# EAGLE design BOARD4 (EAGLE 9.6.2)
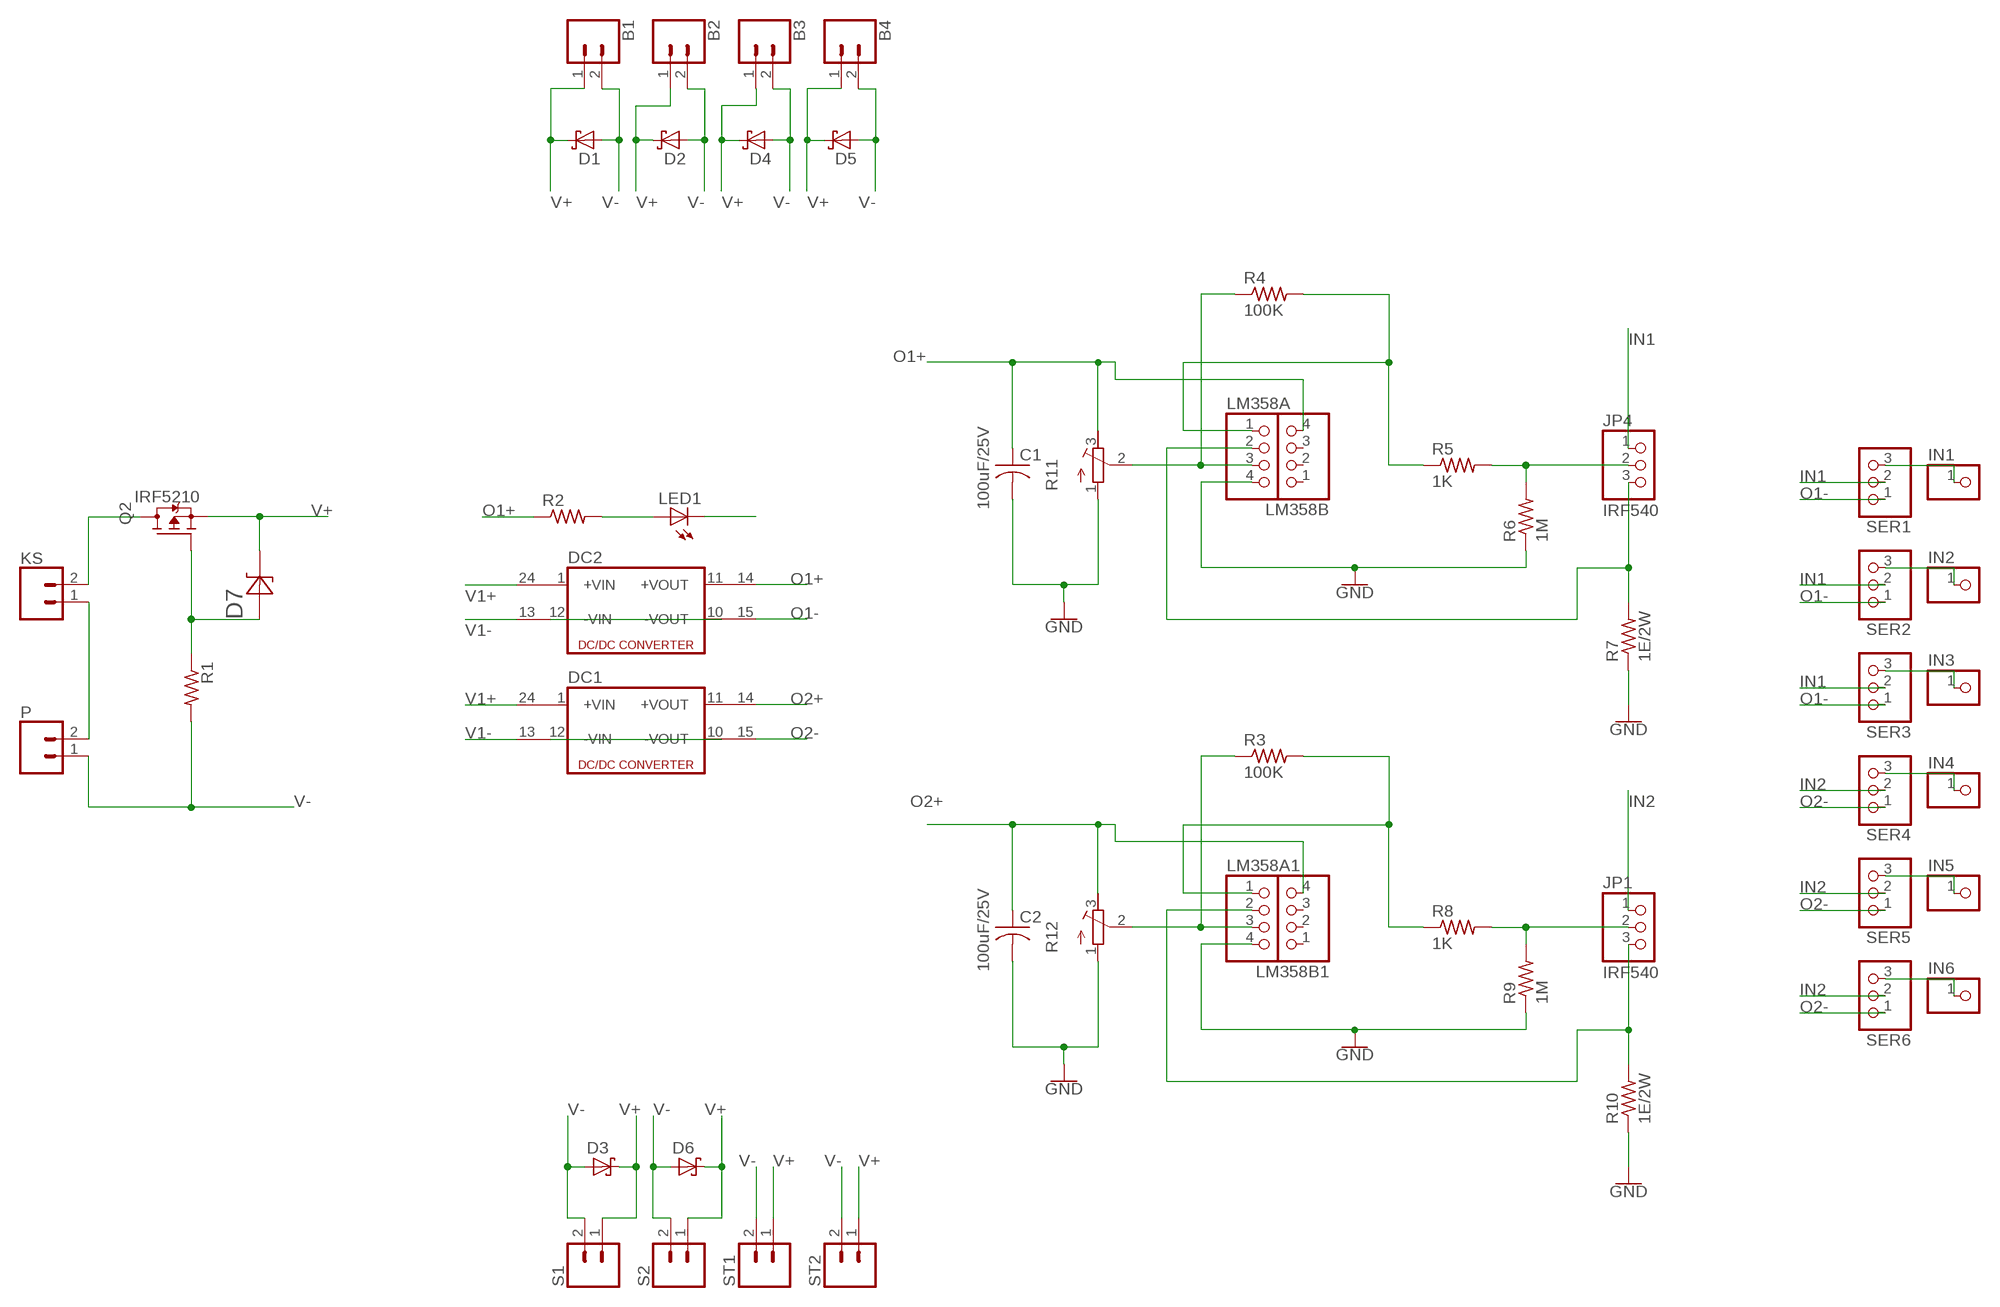
[diagram p0: schematic, sheet 1]

## Parts
B1  CONN_02  [1X02]
B2  CONN_02  [1X02]
B3  CONN_02  [1X02]
B4  CONN_02  [1X02]
C1  100uF/25V  C-US025-024X044  [C025-024X044]
C2  100uF/25V  C-US025-024X044  [C025-024X044]
D1  SCHOTTKY-DIODEF126Z12  [F126Z12]
D2  SCHOTTKY-DIODEF126Z12  [F126Z12]
D3  SCHOTTKY-DIODEF126Z12  [F126Z12]
D4  SCHOTTKY-DIODEF126Z12  [F126Z12]
D5  SCHOTTKY-DIODEF126Z12  [F126Z12]
D6  SCHOTTKY-DIODEF126Z12  [F126Z12]
D7  1N4752A-T  [DIOAD1060W80L410D260]
DC1  DC213R  [CMK]
DC2  DC213R  [CMK]
IN1  PINHD-1X1  [1X01]
IN2  PINHD-1X1  [1X01]
IN3  PINHD-1X1  [1X01]
IN4  PINHD-1X1  [1X01]
IN5  PINHD-1X1  [1X01]
IN6  PINHD-1X1  [1X01]
JP1  IRF540  PINHD-1X3  [1X03]
JP4  IRF540  PINHD-1X3  [1X03]
KS  CONN_02  [1X02]
LED1  LED5MM  [LED5MM]
LM358A  PINHD-1X4  [1X04]
LM358A1  PINHD-1X4  [1X04]
LM358B  PINHD-1X4  [1X04]
LM358B1  PINHD-1X4  [1X04]
P  CONN_02  [1X02]
Q2  IRF5210  [TO254P1054X469X2933-3]
R1  R-US_0204/7  [0204/7]
R2  R-US_0204/7  [0204/7]
R3  100K  R-US_0204/5  [0204/5]
R4  100K  R-US_0204/5  [0204/5]
R5  1K  R-US_0204/5  [0204/5]
R6  1M  R-US_0204/5  [0204/5]
R7  1E/2W  R-US_0204/5  [0204/5]
R8  1K  R-US_0204/5  [0204/5]
R9  1M  R-US_0204/5  [0204/5]
R10  1E/2W  R-US_0204/5  [0204/5]
R11  R-TRIMM3339P  [RTRIM3339P]
R12  R-TRIMM3339P  [RTRIM3339P]
S1  CONN_02  [1X02]
S2  CONN_02  [1X02]
SER1  PINHD-1X3  [1X03]
SER2  PINHD-1X3  [1X03]
SER3  PINHD-1X3  [1X03]
SER4  PINHD-1X3  [1X03]
SER5  PINHD-1X3  [1X03]
SER6  PINHD-1X3  [1X03]
ST1  CONN_02  [1X02]
ST2  CONN_02  [1X02]

## Nets
GND: C1.2 C2.2 LM358A1.4 LM358A.4 R6.1 R7.1 R9.1 R10.1 R11.1(A) R12.1(A)
IN1: JP4.1 SER1.2 SER2.2 SER3.2
IN2: JP1.1 SER4.2 SER5.2 SER6.2
N$1: KS.1 P.2
N$2: KS.2 Q2.2(D)
N$3: D7.A Q2.1(G) R1.1
N$6: JP4.3 LM358A.2 R7.2
N$9: LM358A.3 R4.1 R11.2(S)
N$10: LM358A.1 R4.2 R5.1
N$11: JP4.2 R5.2 R6.2
N$15: LM358A1.3 R3.1 R12.2(S)
N$16: LM358A1.1 R3.2 R8.1
N$17: JP1.2 R8.2 R9.2
N$18: JP1.3 LM358A1.2 R10.2
N$28: DC2.10(-VOUT) DC2.12(-VIN)
N$29: DC1.10(-VOUT) DC1.12(-VIN)
N$38: LED1.A R2.2
N$39: LED1.K(C)
N$53: IN1.1 SER1.3
N$54: IN2.1 SER2.3
N$55: IN3.1 SER3.3
N$56: IN4.1 SER4.3
N$57: IN5.1 SER5.3
N$58: IN6.1 SER6.3
O1+: C1.1 DC2.14(+VOUT1) LM358B.4 R2.1 R11.3(E)
O1-: DC2.15(-VOUT1) SER1.1 SER2.1 SER3.1
O2+: C2.1 DC1.14(+VOUT1) LM358B1.4 R12.3(E)
O2-: DC1.15(-VOUT1) SER4.1 SER5.1 SER6.1
V1+: DC1.24(+VIN1) DC2.24(+VIN1)
V1-: DC1.13(-VIN1) DC2.13(-VIN1)
V+: B1.1 B2.1 B3.1 B4.1 D1.C D2.C D3.C D4.C D5.C D6.C D7.C Q2.3(S) S1.1 S2.1 ST1.1 ST2.1
V-: B1.2 B2.2 B3.2 B4.2 D1.A D2.A D3.A D4.A D5.A D6.A P.1 R1.2 S1.2 S2.2 ST1.2 ST2.2
Unconnected: DC1.1(+VIN) DC1.11(+VOUT) DC2.1(+VIN) DC2.11(+VOUT) LM358B1.1 LM358B1.2 LM358B1.3 LM358B.1 LM358B.2 LM358B.3

## Library data of the parts
B1-B4 KS P S1 S2 ST1 ST2 = SparkFun-Connectors:CONN_02: Multi connection point. Often used as Generic Header-pin footprint for 0.1 inch spaced/style header connections On any of the 0.1 inch spaced packages, you can populate with these: Break Away Headers - Straight <https://www.sparkfun.com/products/116> (PRT-00116) Break Away Male Headers - Right Angle <https://www.sparkfun.com/products/553> (PRT-00553) Female Headers <https://www.sparkfun.com/products/115> (PRT-00115) Break Away Headers - Machine Pin <https://www.sparkfun.com/products/117> (PRT-00117) Break Away Female Headers - Swiss Machine Pin <https://www.sparkfun.com/products/743> (PRT-00743) For SCREWTERMINALS and SPRING TERMINALS visit here: Screw Terimnals on SparkFun.com <https://www.sparkfun.com/search/results?term=Screw+Terminals> (5mm/3.5mm/2.54mm spacing) This device is also useful as a general connection point to wire up your design to another part of your project. Our various solder wires solder well into these plated through hole pads. Hook-Up Wire - Assortment (Stranded, 22 AWG) <https://www.sparkfun.com/products/11375> (PRT-11375) Hook-Up Wire - Assortment (Solid Core, 22 AWG) <https://www.sparkfun.com/products/11367> (PRT-11367) View the entire wire category on our website here <https://www.sparkfun.com/categories/141> Special notes: Molex polarized connector foot print use with: PRT-08233 with associated crimp pins and housings. 2.54_SCREWTERM for use with PRT-10571. 3.5mm Screw Terminal footprints for PRT-08084 5mm Screw Terminal footprints for use with PRT-08432
C1 C2 = rcl:C-US: CAPACITOR, American symbol; SPICEPREFIX: C
D1-D6 = adafruit:SCHOTTKY-DIODE: Schottky Diode
D7 = 1N4752A-T:1N4752A-T: DIODE ZENER 33V 1W DO41 Check prices <https://pricing.snapeda.com/parts/1N4752A/ON%20Semiconductor/view-part?ref=eda>; AVAILABILITY: In Stock; DESCRIPTION: Zener Diode 33 V 1 W ±5% Through Hole DO-41; MF: ON Semiconductor; MP: 1N4752A; PACKAGE: DO-41-2 ON Semiconductor; PRICE: None; PURCHASE-URL: https://pricing.snapeda.com/search/part/1N4752A/?ref=eda
DC1 DC2 = dc-dc-converter:DC213R: DC-DC CONVERTER; OC_FARNELL: unknown; OC_NEWARK: unknown
IN1-IN6 = pinhead:PINHD-1X1: PIN HEADER
JP1 JP4 SER1-SER6 = pinhead:PINHD-1X3: PIN HEADER
LED1 = adafruit:LED: LED OSRAM: - CHIPLED LG R971, LG N971, LY N971, LG Q971, LY Q971, LO R971, LY R971 LH N974, LH R974 LS Q976, LO Q976, LY Q976 LO Q996 - Hyper CHIPLED LW Q18S LB Q993, LB Q99A, LB R99A - SideLED LS A670, LO A670, LY A670, LG A670, LP A670 LB A673, LV A673, LT A673, LW A673 LH A674 LY A675 LS A676, LA A676, LO A676, LY A676, LW A676 LS A679, LY A679, LG A679 - Hyper Micro SIDELED® LS Y876, LA Y876, LO Y876, LY Y876 LT Y87S - SmartLED LW L88C, LW L88S LB L89C, LB L89S, LG L890 LS L89K, LO L89K, LY L89K LS L896, LA L896, LO L896, LY L896 - TOPLED LS T670, LO T670, LY T670, LG T670, LP T670 LSG T670, LSP T670, LSY T670, LOP T670, LYG T670 LG T671, LOG T671, LSG T671 LB T673, LV T673, LT T673, LW T673 LH T674 LS T676, LA T676, LO T676, LY T676, LB T676, LH T676, LSB T676, LW T676 LB T67C, LV T67C, LT T67C, LS T67K, LO T67K, LY T67K, LW E67C LS E67B, LA E67B, LO E67B, LY E67B, LB E67C, LV E67C, LT E67C LW T67C LS T679, LY T679, LG T679 LS T770, LO T770, LY T770, LG T770, LP T770 LB T773, LV T773, LT T773, LW T773 LH T774 LS E675, LA E675, LY E675, LS T675 LS T776, LA T776, LO T776, LY T776, LB T776 LHGB T686 LT T68C, LB T68C - Hyper Mini TOPLED® LB M676 - Mini TOPLED Santana® LG M470 LS M47K, LO M47K, LY M47K Source: http://www.osram.convergy.de/
LM358A LM358A1 LM358B LM358B1 = pinhead:PINHD-1X4: PIN HEADER
Q2 = IRF5210:IRF5210: Check prices <https://pricing.snapeda.com/parts/IRF5210/Infineon%20Technologies/view-part?ref=eda>; AVAILABILITY: In Stock; DESCRIPTION: P-Channel 100V 38A (Tc) 3.1W (Ta), 170W (Tc) Surface Mount D2PAK; MF: Infineon Technologies; MP: IRF5210; PACKAGE: TO-220 Infineon; PRICE: None; PURCHASE-URL: https://pricing.snapeda.com/search/part/IRF5210/?ref=eda
R1-R10 = rcl:R-US_: RESISTOR, American symbol; SPICEPREFIX: R
R11 R12 = rcl:R-TRIMM: Trimm resistor; SPICEMODEL: X; SPICEPREFIXL: POT

## Board
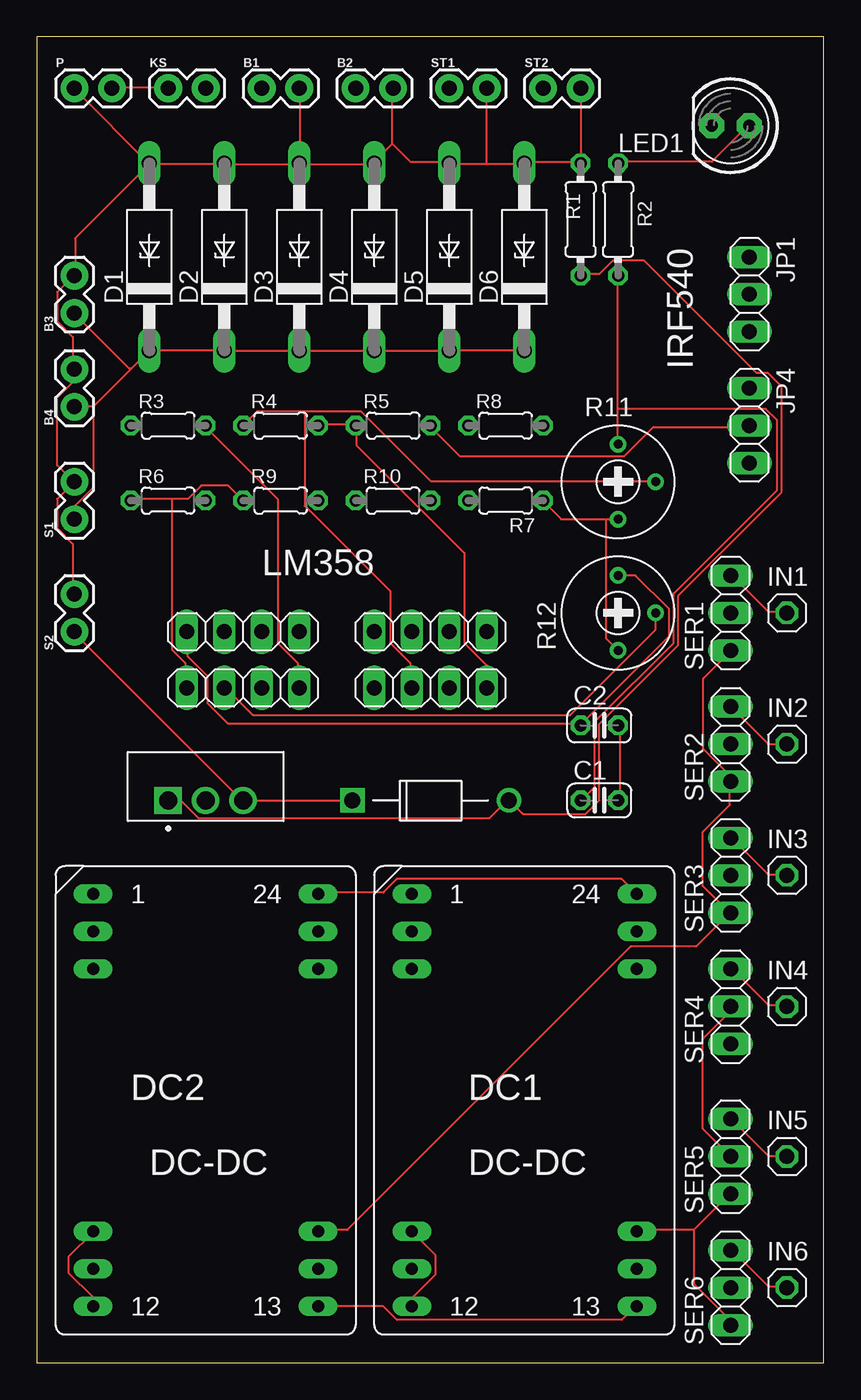
[diagram p1: board, top side]
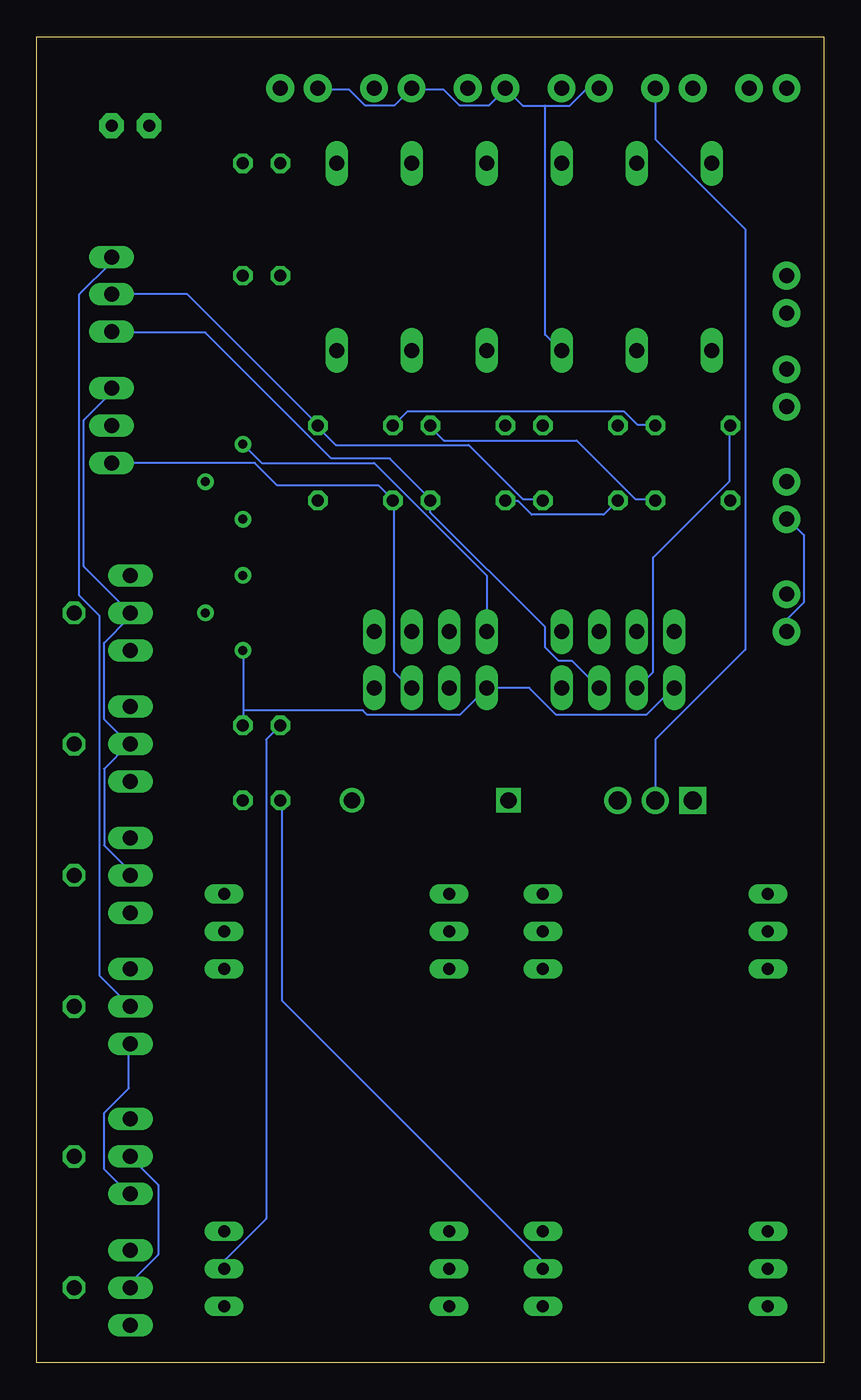
[diagram p2: board, bottom side, seen from below]

Size 53.32 x 89.84 mm. Coordinates in mm from the lower left corner, seen from the top.
Outline: 0,0 53.32,0 53.32,89.84 0,89.84 0,0
Copper layers (1*16): Top 0.035mm / dielectric 1.5mm / Bottom 0.035mm
Design rules "default": minimum track width 6mil, minimum drill 0.35mm, track to track 6mil, track to pad 6mil, pad to pad 6mil, via to via 6mil, smd to smd 6mil, copper to edge 40mil, drill to drill 6mil, minimum pad ring 10mil, minimum via ring 8mil, stop-mask expansion 4mil, vias tented up to drill 0mil, thermal gap 10mil

### Footprints (pad centres in the part's own frame; a part is rotated, then mirrored left to right if it is on the bottom)
1X02 = drill 1.016 pad 1.88: 1 0,0; 2 2.54,0
C025-024X044 = drill 0.813 octagon: 1 -1.27,0; 2 1.27,0
F126Z12 = drill 1.016 long: A 6.35,0; C -6.35,0
DIOAD1060W80L410D260 = drill 1.1 pad 1.65: A 5.3,0 | drill 1.1 pad 1.65 square: C -5.3,0
CMK = drill 0.813 long: 1 -7.62,13.97; 2 -7.62,11.43; 3 -7.62,8.89; 10 -7.62,-8.89; 11 -7.62,-11.43; 12 -7.62,-13.97; 13 7.62,-13.97; 14 7.62,-11.43; 15 7.62,-8.89; 22 7.62,8.89; 23 7.62,11.43; 24 7.62,13.97
1X01 = drill 1.016 octagon: 1 0,0
1X03 = drill 1.016 long: 1 -2.54,0; 2 0,0; 3 2.54,0
LED5MM = drill 0.813 pad 1.676 octagon: A -1.27,0; K 1.27,0
1X04 = drill 1.016 long: 1 -3.81,0; 2 -1.27,0; 3 1.27,0; 4 3.81,0
TO254P1054X469X2933-3 = drill 1.23 pad 1.85 square: 1 0,0 | drill 1.23 pad 1.85: 2 2.54,0; 3 5.08,0
0204/7 = drill 0.813 octagon: 1 -3.81,0; 2 3.81,0
0204/5 = drill 0.813 octagon: 1 -2.54,0; 2 2.54,0
RTRIM3339P = drill 0.61: 1 -2.54,0; 2 0,-2.54; 3 2.54,0

### Placement (x,y rotation side)
B1  15.24,86.36 0 top
B2  21.59,86.36 0 top
B3  2.54,71.12 90 top
B4  2.54,64.77 90 top
C1  38.1,38.1 0 top
C2  38.1,43.18 0 top
D1  7.62,74.93 90 top
D2  12.7,74.93 90 top
D3  17.78,74.93 90 top
D4  22.86,74.93 90 top
D5  27.94,74.93 90 top
D6  33.02,74.93 90 top
D7  26.67,38.1 0 top
DC1  33.02,17.78 0 top
DC2  11.43,17.78 0 top
IN1  50.8,50.8 0 top
IN2  50.8,41.91 0 top
IN3  50.8,33.02 0 top
IN4  50.8,24.13 0 top
IN5  50.8,13.97 0 top
IN6  50.8,5.08 0 top
JP1  48.26,72.39 270 top
JP4  48.26,63.5 270 top
KS  8.89,86.36 0 top
LED1  46.99,83.82 180 top
LM358A  26.67,45.72 180 top
LM358A1  13.97,45.72 180 top
LM358B  26.67,49.53 180 top
LM358B1  13.97,49.53 180 top
P  2.54,86.36 0 top
Q2  8.89,38.1 0 top
R1  36.83,77.47 90 top
R2  39.37,77.47 90 top
R3  8.89,63.5 0 top
R4  16.51,63.5 0 top
R5  24.13,63.5 0 top
R6  8.89,58.42 0 top
R7  31.75,58.42 180 top
R8  31.75,63.5 0 top
R9  16.51,58.42 0 top
R10  24.13,58.42 0 top
R11  39.37,59.69 90 top
R12  39.37,50.8 90 top
S1  2.54,57.15 90 top
S2  2.54,49.53 90 top
SER1  46.99,50.8 90 top
SER2  46.99,41.91 90 top
SER3  46.99,33.02 90 top
SER4  46.99,24.13 90 top
SER5  46.99,13.97 90 top
SER6  46.99,5.08 90 top
ST1  27.94,86.36 0 top
ST2  34.29,86.36 0 top

### Tracks (layer width: path | path; a pad name or v marks a point on that pad's centre or on a via)
GND
  Top 0.152: 38.56,57.15 35.51,57.15 34.29,58.37 R7.1 | 38.56,57.15 R11.1 | C1.2 39.47,38.1 39.47,43.13 C2.2 | 38.56,57.15 38.56,49.07 R12.1 | 9.14,58.52 10.21,58.52 11.12,59.44 12.95,59.44 R9.1 | 9.14,58.52 6.4,58.52 R6.1 | 9.14,58.52 9.14,48.31 10.06,47.4 10.06,45.72 LM358A1.4
  Bottom 0.152: 39.32,44.2 39.32,43.28 C2.2 | 39.32,44.2 39.32,48.16 R12.1 | R9.1 14.94,57.45 19.81,57.45 20.73,58.37 21.49,58.37 R10.1 | LM358A1.4 10.21,45.72 12.04,43.89 18.14,43.89 19.96,45.72 LM358A.4 24.69,43.89 30.94,43.89 31.24,44.2 39.32,44.2
IN1
  Bottom 0.152: 47.09,41.91 48.77,40.23 48.77,35.05 47.09,33.38 47.09,33.07 SER3.2 | 47.09,41.91 48.77,43.59 48.77,48.77 47.09,50.44 47.09,50.75 SER1.2 50.14,53.95 50.14,63.86 48.31,65.68 48.31,65.99 JP4.1 | 47.09,41.91 SER2.2
IN2
  Top 0.152: SER5.2 45.11,15.85 45.11,21.95 46.94,23.77 46.94,24.08 SER4.2
  Bottom 0.152: SER6.2 46.94,5.18 46.94,5.49 45.11,7.32 45.11,12.04 46.94,13.87 SER5.2 | SER4.2 49.07,26.21 49.07,50.6 50.44,51.97 50.44,72.39 48.31,74.52 48.31,74.83 JP1.1
N$1
  Top 0.152: P.2 5.18,86.41 8.84,86.41 KS.1
N$2
  Bottom 0.152: Q2.2 11.43,42.22 5.33,48.31 5.33,76.81 11.43,82.91 KS.2
N$3
  Top 0.152: R1.1 36.88,73.76 38.1,73.76 39.01,74.68 41.15,74.68 48.77,67.06 49.53,67.06 50.44,66.14 50.44,58.98 43.43,51.97 43.43,48.62 38.1,43.28 38.1,38.1 37.19,37.19 32.92,37.19 32,38.1 D7.A 31.85,38.1 30.63,36.88 10.97,36.88 9.75,38.1 Q2.1
N$6
  Bottom 0.152: LM358A.2 28.04,45.72 29.11,46.79 29.11,58.37 R7.2 29.26,58.52 30.18,59.44 37.03,59.44 38.56,60.96 JP4.3
N$9
  Top 0.152: 18.14,64.47 14.94,64.47 R4.1 | 18.14,64.47 21.95,64.47 26.67,59.74 41.91,59.74 R11.2 | 18.14,64.47 18.14,58.06 23.93,52.27 23.93,48.77 25.3,47.4 25.3,45.72 LM358A.3
N$10
  Top 0.152: R4.2 19.05,63.55 21.49,63.55 R5.1 21.64,63.4 21.64,62.18 28.96,54.86 28.96,48.77 30.48,47.24 LM358A.1
N$11
  Top 0.152: JP4.2 48.16,63.4 41.76,63.4 39.78,61.42 28.65,61.42 26.67,63.4 R5.2
  Bottom 0.152: R6.2 11.43,58.52 12.8,58.52 16.76,62.48 25.76,62.48 26.67,63.4 R5.2
N$15
  Top 0.152: R12.2 41.91,49.68 36.12,43.89 14.63,43.89 12.8,45.72 LM358A1.3
  Bottom 0.152: R3.1 6.4,63.4 6.4,59.74 11.58,54.56 11.58,46.79 12.65,45.72 LM358A1.3
N$16
  Top 0.152: LM358A1.1 17.68,45.72 17.68,47.4 16.31,48.77 16.31,58.52 11.43,63.4 R3.2
  Bottom 0.152: R3.2 11.43,63.55 12.65,63.55 13.56,64.47 28.19,64.47 29.11,63.55 R8.1
N$17
  Bottom 0.152: R9.2 19.05,58.52 20.42,58.52 24.08,62.18 33.07,62.18 34.29,63.4 R8.2 34.29,63.55 43.13,72.39 JP1.2
N$18
  Bottom 0.152: LM358A1.2 17.07,47.55 17.98,47.55 18.9,48.46 18.9,49.84 26.67,57.61 R10.2 26.67,58.52 29.41,61.27 33.38,61.27 41.91,69.8 48.16,69.8 JP1.3
N$28
  Top 0.152: DC2.12 3.81,4.42 2.13,6.1 2.13,7.16 3.81,8.84 DC2.10
N$29
  Top 0.152: DC1.10 26.98,7.32 26.98,5.94 25.45,4.42 25.45,3.81 DC1.12
N$38
  Top 0.152: R2.2 39.47,81.38 45.72,81.38 48.16,83.82 LED1.A
N$53
  Top 0.152: IN1.1 50.75,50.9 49.53,50.9 47.09,53.34 SER1.3
N$54
  Top 0.152: IN2.1 49.53,41.91 SER2.3
N$55
  Top 0.152: IN3.1 50.75,33.07 49.53,33.07 47.09,35.51 SER3.3
N$56
  Top 0.152: IN4.1 50.75,24.23 49.53,24.23 47.09,26.67 SER4.3
N$57
  Top 0.152: IN5.1 50.75,14.02 49.53,14.02 47.09,16.46 SER5.3
N$58
  Top 0.152: IN6.1 50.75,5.18 49.53,5.18 47.09,7.62 SER6.3
O1+
  Top 0.152: 39.32,64.62 39.32,73.61 R2.1 | 39.32,64.62 39.32,62.33 R11.3 | 39.32,64.62 49.38,64.62 50.14,63.86 50.14,59.13 43.13,52.12 43.13,48.77 37.8,43.43 37.8,39.01 36.88,38.1 C1.1
  Bottom 0.152: LM358B.4 22.86,53.34 30.48,60.96 38.1,60.96 R11.3 | DC2.14 19.05,6.86 36.73,24.54 36.73,38.1 C1.1
O1-
  Top 0.152: SER1.1 46.94,48.16 45.11,46.33 45.11,41.6 46.94,39.78 46.94,39.47 SER2.1 46.94,39.32 46.94,37.8 45.11,35.97 45.11,32.31 46.94,30.48 | 46.94,30.48 44.65,28.19 40.23,28.19 21.03,8.99 19.05,8.99 DC2.15 | 46.94,30.48 SER3.1
O2+
  Top 0.152: R12.3 40.54,53.34 42.82,51.05 42.82,49.23 36.88,43.28 C2.1 36.73,43.28 12.95,43.28 11.58,44.65 11.58,46.48 10.21,47.85 10.21,49.53 LM358B1.4
  Bottom 0.152: C2.1 37.8,42.22 37.8,9.75 40.54,7.01 40.54,6.4 DC1.14
O2-
  Top 0.152: 44.5,8.99 40.69,8.99 DC1.15 | 44.5,8.99 46.94,11.43 SER5.1 | 44.5,8.99 44.5,5.33 46.94,2.9 46.94,2.59 SER6.1
  Bottom 0.152: SER4.1 47.09,21.49 47.09,18.59 48.77,16.92 48.77,13.11 47.09,11.43 SER5.1
V1+
  Top 0.152: DC1.24 39.62,32.77 24.38,32.77 23.47,31.85 19.05,31.85 DC2.24
V1-
  Top 0.152: DC2.13 23.47,3.81 24.38,2.9 39.62,2.9 40.54,3.81 DC1.13
V+
  Top 0.152: D7.C Q2.3 13.87,38.1 2.44,49.53 S2.1 | D6.C D5.C D4.C D3.C D2.C D1.C 6.4,67.36 | 3.81,64.77 B4.1 | 6.4,67.36 3.81,64.77 | 6.4,67.36 6.25,67.36 2.59,71.02 B3.1 | 3.81,64.77 3.81,59.28 2.59,58.06 2.59,57.15 S1.1
  Bottom 0.152: S2.1 2.44,49.53 2.44,50.44 1.37,51.51 1.37,56.08 2.44,57.15 S1.1 | 18.9,85.19 20.42,85.19 B2.1 21.64,86.26 22.71,85.19 24.69,85.19 25.76,86.26 27.89,86.26 ST1.1 29.11,85.19 31.09,85.19 32.16,86.26 34.29,86.26 ST2.1 | 18.9,85.19 17.22,85.19 16.15,86.26 15.24,86.26 B1.1 | 18.9,85.19 18.9,69.65 17.83,68.58 D3.C
V-
  Top 0.152: S2.2 2.44,52.12 2.44,55.47 1.37,56.54 1.37,58.52 S1.2 2.44,59.74 1.37,60.81 1.37,65.38 2.44,66.45 2.44,67.21 B4.2 2.44,67.36 2.44,69.49 1.37,70.56 1.37,72.54 2.44,73.61 B3.2 2.59,73.76 2.59,76.2 7.62,81.23 | 30.48,81.23 32.92,81.23 D6.A 33.07,81.38 36.73,81.38 R1.2 36.88,81.38 36.88,86.26 ST2.2 | 30.48,81.23 28.04,81.23 D5.A 27.89,81.38 25.3,81.38 24.08,82.6 | 30.48,81.23 ST1.2 | 7.62,81.23 12.65,81.23 D2.A 12.8,81.23 17.68,81.23 D3.A | D3.A 17.83,81.23 22.86,81.23 D4.A 22.86,81.38 24.08,82.6 | 7.62,81.23 2.59,86.26 P.1 | B1.2 17.83,86.26 17.83,81.38 D3.A | 24.08,82.6 24.08,86.26 B2.2 | 7.62,81.23 D1.A

### Text on the board
tNames: IRF540 | LM358